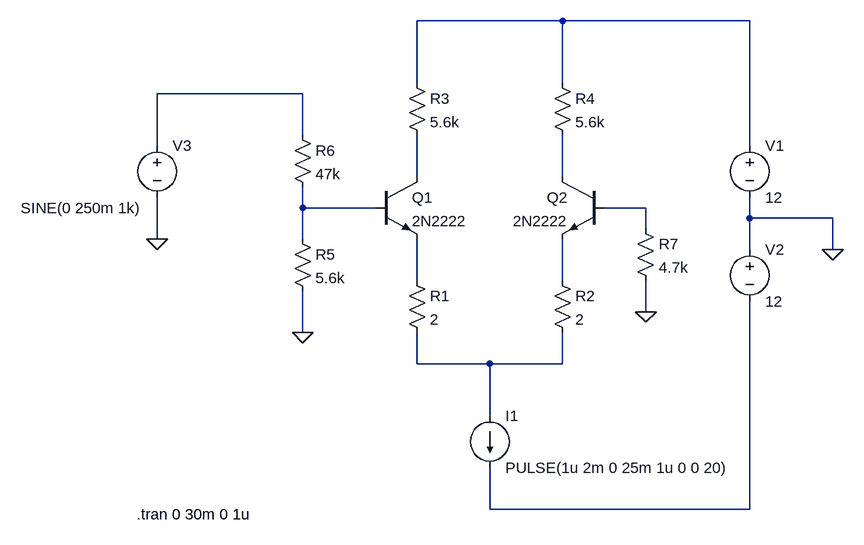
[diagram p0: schematic diff_pair.asc]
diff_pair.asc, the LTspice schematic file:
Version 4
SHEET 1 880 680
WIRE 400 -128 176 -128
WIRE 688 -128 400 -128
WIRE 176 -32 176 -128
WIRE 400 -32 400 -128
WIRE 0 -16 -224 -16
WIRE 0 48 0 -16
WIRE -224 64 -224 -16
WIRE 688 64 688 -128
WIRE 176 112 176 48
WIRE 400 112 400 48
WIRE 0 160 0 128
WIRE 112 160 0 160
WIRE 528 160 464 160
WIRE 688 176 688 144
WIRE 816 176 688 176
WIRE 528 192 528 160
WIRE -224 208 -224 144
WIRE 0 208 0 160
WIRE 688 224 688 176
WIRE 816 224 816 176
WIRE 176 272 176 208
WIRE 400 272 400 208
WIRE 528 320 528 272
WIRE 0 352 0 288
WIRE 176 400 176 352
WIRE 288 400 176 400
WIRE 400 400 400 352
WIRE 400 400 288 400
WIRE 288 480 288 400
WIRE 288 624 288 560
WIRE 688 624 688 304
WIRE 688 624 288 624
FLAG 816 224 0
FLAG -224 208 0
FLAG 0 352 0
FLAG 528 320 0
SYMBOL npn2 112 112 R0
SYMATTR InstName Q1
SYMATTR Value 2N2222
SYMBOL npn2 464 112 M0
SYMATTR InstName Q2
SYMATTR Value 2N2222
SYMBOL res 160 256 R0
SYMATTR InstName R1
SYMATTR Value 2
SYMBOL res 384 256 R0
SYMATTR InstName R2
SYMATTR Value 2
SYMBOL voltage 688 48 R0
WINDOW 123 0 0 Left 0
WINDOW 39 0 0 Left 0
SYMATTR InstName V1
SYMATTR Value 12
SYMBOL voltage 688 208 R0
WINDOW 123 0 0 Left 0
WINDOW 39 0 0 Left 0
SYMATTR InstName V2
SYMATTR Value 12
SYMBOL current 288 480 R0
WINDOW 123 0 0 Left 0
WINDOW 39 0 0 Left 0
SYMATTR InstName I1
SYMATTR Value PULSE(1u 2m 0 25m 1u 0 0 20)
SYMBOL res 160 -48 R0
SYMATTR InstName R3
SYMATTR Value 5.6k
SYMBOL res 384 -48 R0
SYMATTR InstName R4
SYMATTR Value 5.6k
SYMBOL voltage -224 48 R0
WINDOW 3 -210 112 Left 2
WINDOW 123 0 0 Left 0
WINDOW 39 0 0 Left 0
SYMATTR Value SINE(0 250m 1k)
SYMATTR InstName V3
SYMBOL res -16 192 R0
SYMATTR InstName R5
SYMATTR Value 5.6k
SYMBOL res -16 32 R0
SYMATTR InstName R6
SYMATTR Value 47k
SYMBOL res 512 176 R0
SYMATTR InstName R7
SYMATTR Value 4.7k
TEXT -256 632 Left 2 !.tran 0 30m 0 1u

The netlist it stands for:
* diff_pair.asc
Q1 N003 N005 N007 0 2N2222
Q2 N004 N006 N008 0 2N2222
R1 N007 N009 2
R2 N008 N009 2
V1 N001 0 12
V2 0 N010 12
I1 N009 N010 PULSE(1u 2m 0 25m 1u 0 0 20)
R3 N001 N003 5.6k
R4 N001 N004 5.6k
V3 N002 0 SINE(0 250m 1k)
R5 N005 0 5.6k
R6 N002 N005 47k
R7 N006 0 4.7k
.model NPN NPN
.model PNP PNP
.lib standard.bjt
.tran 0 30m 0 1u
.backanno
.end